# Altium schematic sheet MCU.SchDoc
size A3
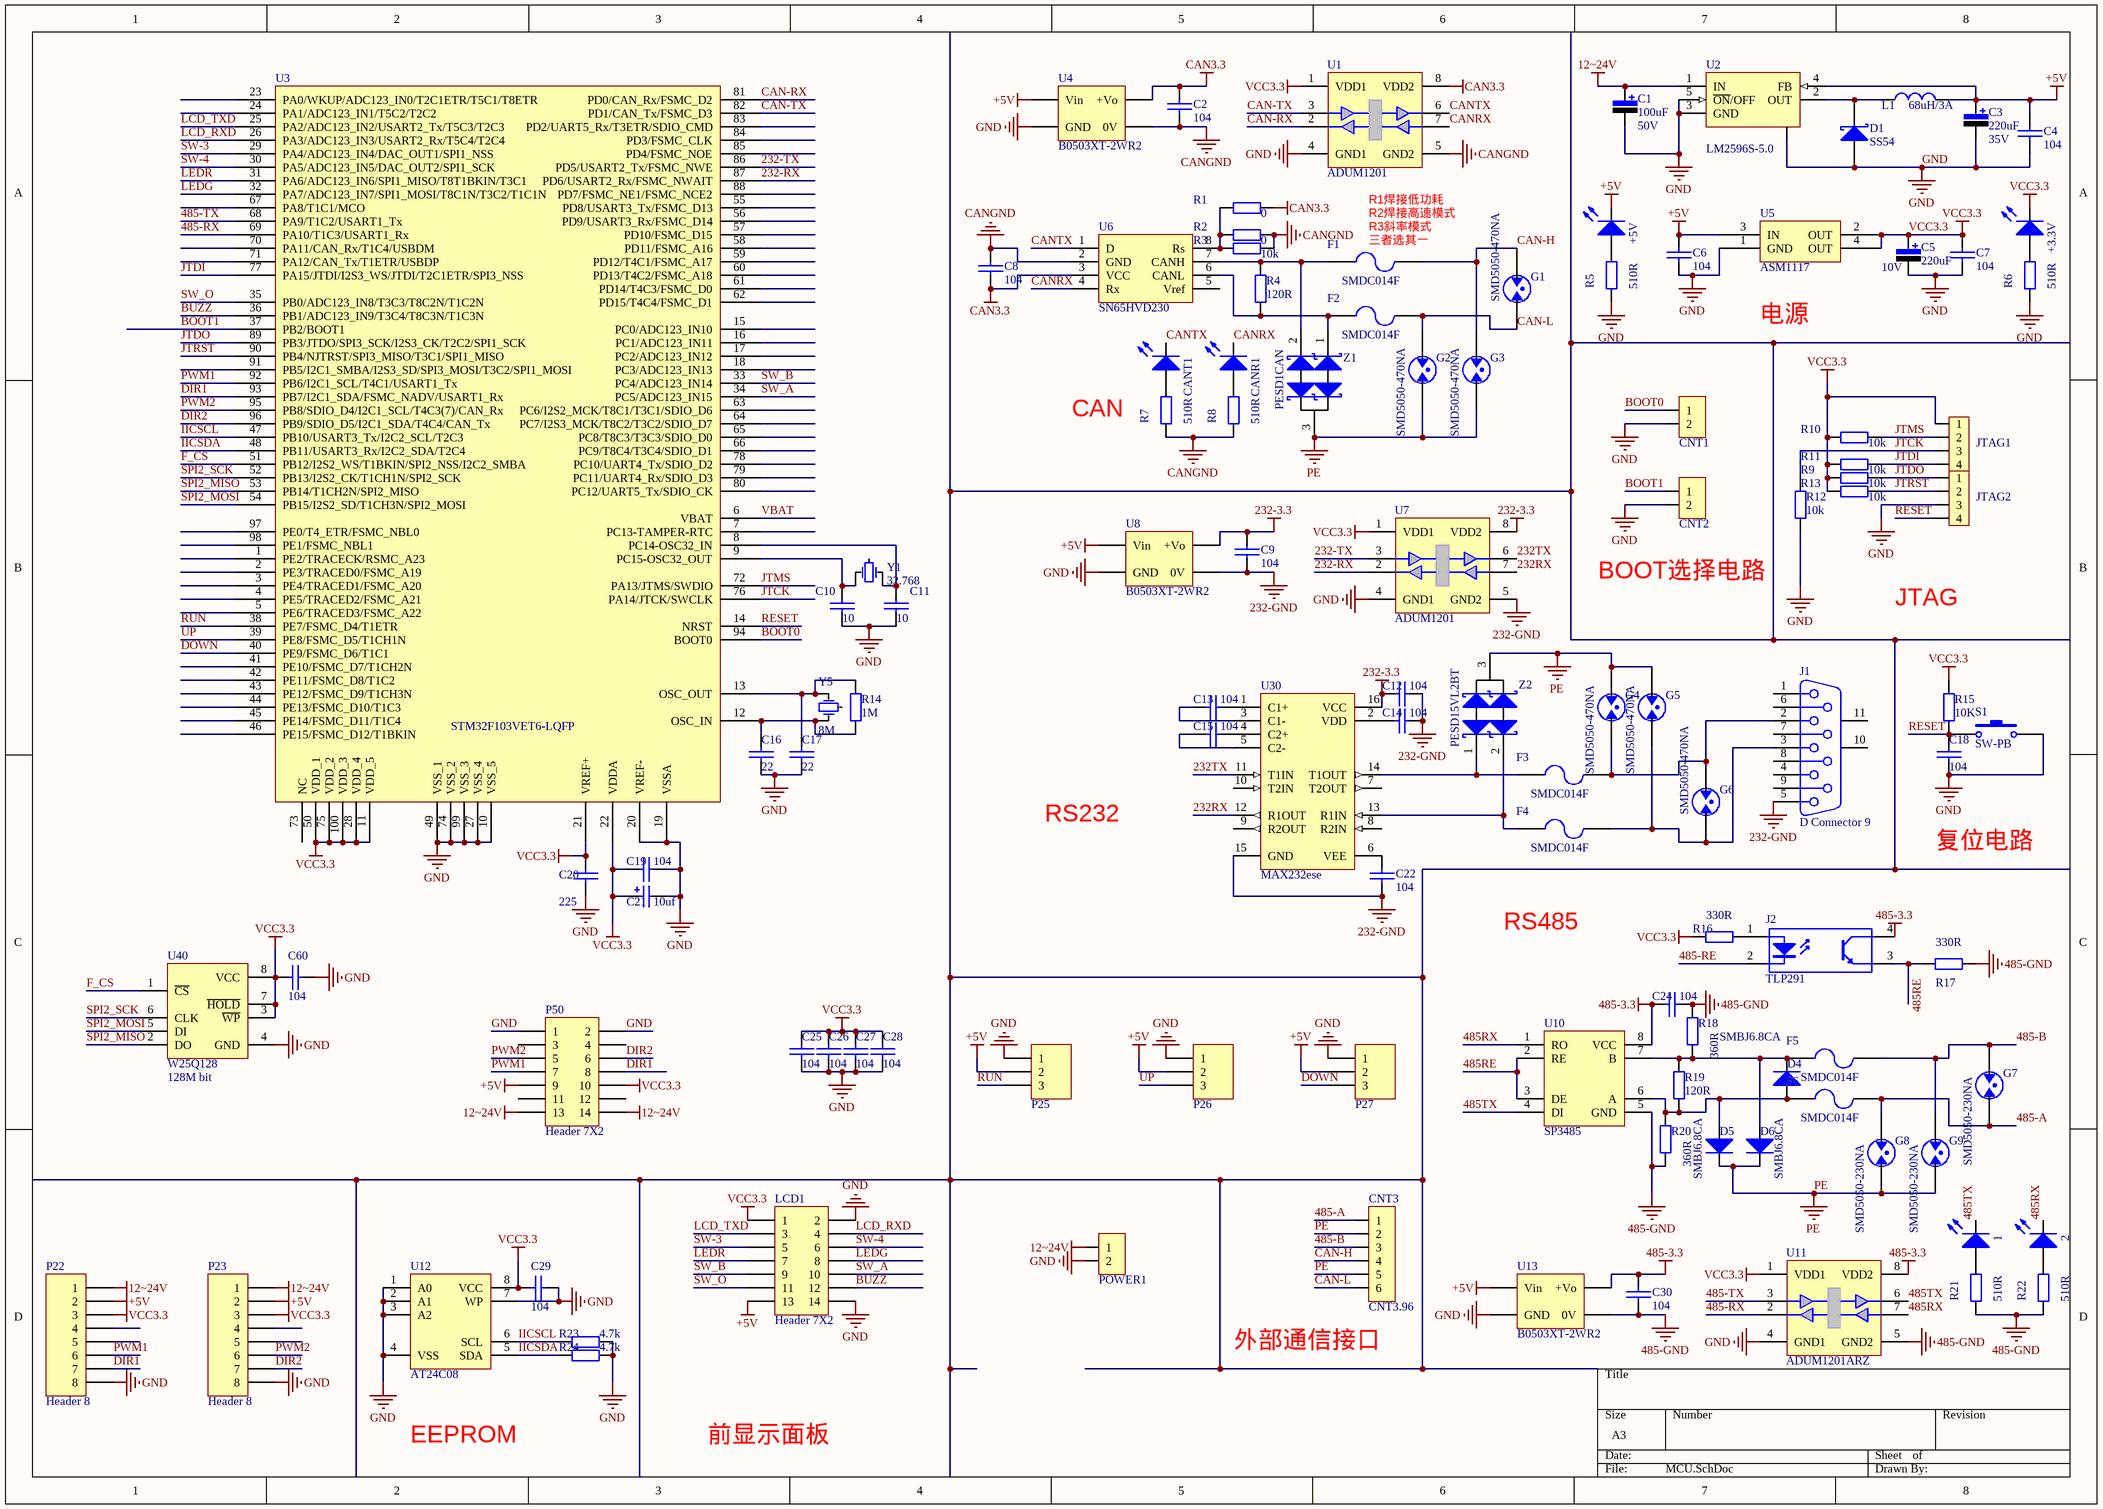
[diagram p0: MCU.SchDoc]

## Parts
1  COLOUR  [0603LED]  (value not drawn)
2  COLOUR  [0603LED]  (value not drawn)
+3.3V  COLOUR  [0603LED]  (value not drawn)
+5V  COLOUR  [0603LED]  (value not drawn)
C1  value 100uF  Vol: 50V  [C-RB-S10]  (hidden comment: Cap Pol)
C2  104  [0603C]
C3  value 220uF  Vol: 35V  [C-RB-S10]  (hidden comment: Cap Pol)
C4  104  [0603C]
C5  value 220uF  Vol: 10V  [CAP-7343]  (hidden comment: Cap Pol)
C6  104  [0603C]
C7  104  [0603C]
C8  104  [0603C]
C9  104  [0603C]
C10  10  [0603C]
C11  10  [0603C]
C12  104  [0603C]
C13  104  [0603C]
C14  104  [0603C]
C15  104  [0603C]
C16  22  [0603C]
C17  22  [0603C]
C18  104  [0603C]
C19  104  [0603C]
C20  225  [0603C]
C21  10uf  [ct3216-18]
C22  104  [0603C]
C24  104  [0603C]
C25  104  [0603C]
C26  104  [0603C]
C27  104  [0603C]
C28  104  [0603C]
C29  104  [0603C]
C30  104  [0603C]
C60  104  [0603C]
CANR1  COLOUR  [0603LED]  (value not drawn)
CANT1  COLOUR  [0603LED]  (value not drawn)
CNT1  cnt2p  [cont-1]  (value not drawn)
CNT2  cnt2p  [cont-1]  (value not drawn)
CNT3  CNT3.96  [CNT3.96]
D1  Type: SS54  [DIODE-SMA]  (hidden comment: D-Schottky)
D4  Type: SMBJ6.8CA  [DIODE-SMB]  (hidden comment: TVS)
D5  Type: SMBJ6.8CA  [DIODE-SMB]  (hidden comment: TVS)
D6  Type: SMBJ6.8CA  [DIODE-SMB]  (hidden comment: TVS)
F1  SMDC014F  [1812]
F2  value SMDC014F  [1812]  (hidden comment: Fuse)
F3  SMDC014F  [1812]
F4  value SMDC014F  [1812]  (hidden comment: Fuse)
F5  SMDC014F  [1812]
F6  value SMDC014F  [1812]  (hidden comment: Fuse)
G1  SMD5050-470NA  [SMD5050]
G2  SMD5050-470NA  [SMD5050]
G3  SMD5050-470NA  [SMD5050]
G4  SMD5050-470NA  [SMD5050]
G5  SMD5050-470NA  [SMD5050]
G6  SMD5050-470NA  [SMD5050]
G7  SMD5050-230NA  [SMD5050]
G8  SMD5050-230NA  [SMD5050]
G9  SMD5050-230NA  [SMD5050]
J1  D Connector 9  [DB9-M]
J2  TLP291  [SOP127P710X350-4N]
JTAG1  单排插针11mm4p  [单排插针2.54]  (value not drawn)
JTAG2  单排插针11mm4p  [单排插针2.54]  (value not drawn)
L1  value 68uH/3A  [L-SMD-12]  (hidden comment: Inductor)
LCD1  Header 7X2  [HDR7X2_A1]
P22  Header 8  [PH2.0-8P]
P23  Header 8  [PH2.0-8P]
P25  Header 3  [XH2.54*3卧贴]  (value not drawn)
P26  Header 3  [XH2.54*3卧贴]  (value not drawn)
P27  Header 3  [XH2.54*3卧贴]  (value not drawn)
P50  Header 7X2  [HDR7X2_A1]
POWER1  CNT5.08MM*2 WAN  [CNT5.08*2WAN]  (value not drawn)
R1  value 0  [0603-1]  (hidden comment: Res1)
R2  value 0  [0603-1]  (hidden comment: Res1)
R3  value 10k  [0603-1]  (hidden comment: Res1)
R4  value 120R  [0603-1]  (hidden comment: Res1)
R5  value 510R  [0603-1]  (hidden comment: Res1)
R6  value 510R  [0603-1]  (hidden comment: Res1)
R7  value 510R  [0603-1]  (hidden comment: Res1)
R8  value 510R  [0603-1]  (hidden comment: Res1)
R9  value 10k  [0603-1]  (hidden comment: Res1)
R10  value 10k  [0603-1]  (hidden comment: Res1)
R11  value 10k  [0603-1]  (hidden comment: Res1)
R12  value 10k  [0603-1]  (hidden comment: Res1)
R13  value 10k  [0603-1]  (hidden comment: Res1)
R14  value 1M  [0603-1]  (hidden comment: Res1)
R15  value 10K  [0603-1]  (hidden comment: Res1)
R16  value 330R  [0603-1]  (hidden comment: Res1)
R17  value 330R  [0603-1]  (hidden comment: Res1)
R18  value 360R  [0603-1]  (hidden comment: Res1)
R19  value 120R  [0603-1]  (hidden comment: Res1)
R20  value 360R  [0603-1]  (hidden comment: Res1)
R21  value 510R  [0603-1]  (hidden comment: Res1)
R22  value 510R  [0603-1]  (hidden comment: Res1)
R23  value 4.7k  [0603-1]  (hidden comment: Res1)
R24  value 4.7k  [0603-1]  (hidden comment: Res1)
S1  SW-PB  [SW_PB4_A1]
U1  ADUM1201  [NSO8_N]
U2  LM2596S-5.0  [TO-263-5]
U3  STM32F103VET6-LQFP  [LQFP-100_M]
U4  B0503XT-2WR2  [B_XT-2WR2]
U5  ASM1117  [SOT-223]
U6  SN65HVD230  [NSO8_N]
U7  ADUM1201  [NSO8_N]
U8  B0503XT-2WR2  [B_XT-2WR2]
U10  SP3485  [NSO8_N]
U11  ADUM1201ARZ  [NSO8_N]
U12  AT24C08  [SOIC8_N]
U13  B0503XT-2WR2  [B_XT-2WR2]
U30  MAX232ese  [NSO16_M]
U40  W25Q128  Memory: 128M bit  [SOIC8_W]
Y1  value 32.768  [MC-146]  (hidden comment: XTAL_SM)
Y5  value 8M  [xtal3225]  (hidden comment: XTAL_SM)
Z1  PESD1CAN  [SOT-23]
Z2  PESD15VL2BT  [SOT-23]

## Nets
12~24V: C1.1 P22.1 P23.1 P50.13 P50.14 POWER1.1 U2.1(IN)
232-3.3: C9.1 C12.2 U7.8(VDD2) U8.9(+Vo) U30.16(VCC)
232-GND: C9.2 C12.1 C14.1 C22.1 J1.5 U7.5(GND2) U8.8(0V) U30.15(GND)
485-3.3: C24.2 C30.1 J2.4(C) U10.8(VCC) U11.8(VDD2) U13.9(+Vo)
485-GND: C24.1 C30.2 R17.1 R18.2 R20.1 R21.1 R22.1 U10.5(GND) U11.5(GND2) U13.8(0V)
+5V: +5V.2(-) C3.1 C4.1 C6.1 L1.2 LCD1.13 P22.2 P23.2 P25.2 P26.2 P27.2 P50.9 U2.4(FB) U4.14(Vin) U5.3(IN) U8.14(Vin) U13.14(Vin)
CAN3.3: C2.1 C8.2 R1.1 U1.8(VDD2) U4.9(+Vo) U6.3(VCC)
CANGND: C2.2 C8.1 R2.1 R3.1 R7.1 R8.1 U1.5(GND2) U4.8(0V) U6.2(GND)
GND: C1.2 C3.2 C4.2 C5.2 C6.2 C7.2 C10.2 C11.2 C16.2 C17.2 C18.1 C19.1 C20.1 C21.2 C25.1 C26.1 C27.1 C28.1 C29.1 C60.1 CNT1.2 CNT2.2 D1.1(A) JTAG2.3 LCD1.2 LCD1.14 P22.8 P23.8 P25.1 P26.1 P27.1 P50.1 P50.2 POWER1.2 R5.1 R6.1 R12.2 R23.1 R24.1 S1.2 U1.4(GND1) U2.3(GND) U2.5(~{ON}/OFF) U2.6 U3.10(VSS_5) U3.19(VSSA) U3.20(VREF-) U3.27(VSS_4) U3.49(VSS_1) U3.74(VSS_2) U3.99(VSS_3) U4.1(GND) U5.1(GND) U7.4(GND1) U8.1(GND) U11.4(GND1) U12.1(A0) U12.2(A1) U12.3(A2) U12.4(VSS) U12.7(WP) U13.1(GND) U40.4(GND)
PE: CNT3.2 CNT3.5 D5.2(K) D6.2(K) G2.2 G3.2 G4.1 G5.1 G8.2 G9.2 Z1.3 Z2.3
VCC3.3: +3.3V.2(-) C5.1 C7.1 C19.2 C20.2 C21.1 C25.2 C26.2 C27.2 C28.2 C29.2 C60.2 JTAG1.1 LCD1.1 P22.3 P23.3 P50.10 R9.2 R10.2 R11.2 R13.2 R15.2 R16.2 U1.1(VDD1) U3.11(VDD_5) U3.21(VREF+) U3.22(VDDA) U3.28(VDD_4) U3.50(VDD_1) U3.75(VDD_2) U3.100(VDD_3) U5.2(OUT) U5.4(OUT) U7.1(VDD1) U11.1(VDD1) U12.8(VCC) U40.3(~{WP}) U40.7(~{HOLD}) U40.8(VCC)
232-RX: U3.87(PD6/USART2_Rx/FSMC_NWAIT) U7.2(Voa)
232-TX: U3.86(PD5/USART2_Tx/FSMC_NWE) U7.3(Vib)
232RX: U7.7(Via) U30.12(R1OUT)
232TX: U7.6(Vob) U30.11(T1IN)
485-A: CNT3.1 F6.2 G7.2 G8.1
485-B: CNT3.3 F5.2 G7.1 G9.1
485-RE: J2.2(K)
485-RX: U3.69(PA10/T1C3/USART1_Rx) U11.2(Voa)
485-TX: U3.68(PA9/T1C2/USART1_Tx) U11.3(Vib)
485RE: J2.3(E) R17.2 U10.2(RE) U10.3(DE)
485RX: 2.2(-) U10.1(RO) U11.7(Via)
485TX: 1.2(-) U10.4(DI) U11.6(Vob)
BOOT0: CNT1.1 U3.94(BOOT0)
BOOT1: CNT2.1 U3.37(PB2/BOOT1)
BUZZ: LCD1.12 U3.36(PB1/ADC123_IN9/T3C4/T8C3N/T1C3N)
CAN-H: CNT3.4 F1.2 G1.1 G3.1
CAN-L: CNT3.6 F2.2 G1.2 G2.1
CAN-RX: U1.2(Voa) U3.81(PD0/CAN_Rx/FSMC_D2)
CAN-TX: U1.3(Vib) U3.82(PD1/CAN_Tx/FSMC_D3)
CANRX: CANR1.2(-) U1.7(Via) U6.4(Rx)
CANTX: CANT1.2(-) U1.6(Vob) U6.1(D)
DIR1: P22.7 P50.8 U3.93(PB7/I2C1_SDA/FSMC_NADV/USART1_Rx)
DIR2: P23.7 P50.6 U3.96(PB9/SDIO_D5/I2C1_SDA/T4C4/CAN_Tx)
DOWN: P27.3 U3.40(PE9/FSMC_D6/T1C1)
F_CS: U3.51(PB12/I2S2_WS/T1BKIN/SPI2_NSS/I2C2_SMBA) U40.1(~{CS})
IICSCL: R23.2 U3.47(PB10/USART3_Tx/I2C2_SCL/T2C3) U12.6(SCL)
IICSDA: R24.2 U3.48(PB11/USART3_Rx/I2C2_SDA/T2C4) U12.5(SDA)
JTCK: JTAG1.3 R12.1 U3.76(PA14/JTCK/SWCLK)
JTDI: JTAG1.4 R11.1 U3.77(PA15/JTDI/I2S3_WS/JTDI/T2C1ETR/SPI3_NSS)
JTDO: JTAG2.1 R9.1 U3.89(PB3/JTDO/SPI3_SCK/I2S3_CK/T2C2/SPI1_SCK)
JTMS: JTAG1.2 R10.1 U3.72(PA13/JTMS/SWDIO)
JTRST: JTAG2.2 R13.1 U3.90(PB4/NJTRST/SPI3_MISO/T3C1/SPI1_MISO)
LCD_RXD: LCD1.4 U3.26(PA3/ADC123_IN3/USART2_Rx/T5C4/T2C4)
LCD_TXD: LCD1.3 U3.25(PA2/ADC123_IN2/USART2_Tx/T5C3/T2C3)
LEDG: LCD1.8 U3.32(PA7/ADC123_IN7/SPI1_MOSI/T8C1N/T3C2/T1C1N)
LEDR: LCD1.7 U3.31(PA6/ADC123_IN6/SPI1_MISO/T8T1BKIN/T3C1)
PWM1: P22.6 P50.7 U3.92(PB6/I2C1_SCL/T4C1/USART1_Tx)
PWM2: P23.6 P50.5 U3.95(PB8/SDIO_D4/I2C1_SCL/T4C3(7)/CAN_Rx)
RESET: C18.2 JTAG2.4 R15.1 S1.1 U3.14(NRST)
RUN: P25.3 U3.38(PE7/FSMC_D4/T1ETR)
SPI2_MISO: U3.53(PB14/T1CH2N/SPI2_MISO) U40.2(DO)
SPI2_MOSI: U3.54(PB15/I2S2_SD/T1CH3N/SPI2_MOSI) U40.5(DI)
SPI2_SCK: U3.52(PB13/I2S2_CK/T1CH1N/SPI2_SCK) U40.6(CLK)
SW-3: LCD1.5 U3.29(PA4/ADC123_IN4/DAC_OUT1/SPI1_NSS)
SW-4: LCD1.6 U3.30(PA5/ADC123_IN5/DAC_OUT2/SPI1_SCK)
SW_A: LCD1.10 U3.34(PC5/ADC123_IN15)
SW_B: LCD1.9 U3.33(PC4/ADC123_IN14)
SW_O: LCD1.11 U3.35(PB0/ADC123_IN8/T3C3/T8C2N/T1C2N)
UP: P26.3 U3.39(PE8/FSMC_D5/T1CH1N)
VBAT: U3.6(VBAT)
Net1_1: 1.1(+) R21.2
Net2_1: 2.1(+) R22.2
Net+3.3V_1: +3.3V.1(+) R6.2
Net+5V_1: +5V.1(+) R5.2
NetC10_1: C10.1 U3.9(PC15-OSC32_OUT) Y1.1(OSC1)
NetC11_1: C11.1 U3.8(PC14-OSC32_IN) Y1.2(OSC2)
NetC13_1: C13.1 U30.1(C1+)
NetC13_2: C13.2 U30.3(C1-)
NetC14_2: C14.2 U30.2(VDD)
NetC15_1: C15.1 U30.4(C2+)
NetC15_2: C15.2 U30.5(C2-)
NetC16_1: C16.1 R14.1 U3.12(OSC_IN) Y5.1(OSC1)
NetC17_1: C17.1 R14.2 U3.13(OSC_OUT) Y5.2(OSC2)
NetC22_2: C22.2 U30.6(VEE)
NetCANR1_1: CANR1.1(+) R8.2
NetCANT1_1: CANT1.1(+) R7.2
NetD1_2: D1.2(K) L1.1 U2.2(OUT)
NetD4_1: D4.1(A) D5.1(A) F6.1 R19.1 R20.2 U10.6(A)
NetD4_2: D4.2(K) D6.1(A) F5.1 R18.1 R19.2 U10.7(B)
NetF1_1: F1.1 R4.2 U6.7(CANH) Z1.2
NetF2_1: F2.1 R4.1 U6.6(CANL) Z1.1
NetF3_1: F3.1 U30.14(T1OUT) Z2.1
NetF3_2: F3.2 G4.2 G6.1 J1.2
NetF4_1: F4.1 U30.13(R1IN) Z2.2
NetF4_2: F4.2 G5.2 G6.2 J1.3
NetJ2_1: J2.1(A) R16.1
NetR1_2: R1.2 R2.2 R3.2 U6.8(Rs)

Not connected (* = marked no-connect by the designer): J1 1 4 6 7 8 9 10(MH1) 11(MH2); P22 4 5; P23 4 5; P50 3 4 11 12; U3 1(PE2/TRACECK/RSMC_A23) 2(PE3/TRACED0/FSMC_A19) 3(PE4/TRACED1/FSMC_A20) 4(PE5/TRACED2/FSMC_A21) 5(PE6/TRACED3/FSMC_A22) 7(PC13-TAMPER-RTC) 15(PC0/ADC123_IN10) 16(PC1/ADC123_IN11) 17(PC2/ADC123_IN12) 18(PC3/ADC123_IN13) 23(PA0/WKUP/ADC123_IN0/T2C1ETR/T5C1/T8ETR) 24(PA1/ADC123_IN1/T5C2/T2C2) 41(PE10/FSMC_D7/T1CH2N) 42(PE11/FSMC_D8/T1C2) 43(PE12/FSMC_D9/T1CH3N) 44(PE13/FSMC_D10/T1C3) 45(PE14/FSMC_D11/T1C4) 46(PE15/FSMC_D12/T1BKIN) 55(PD8/USART3_Tx/FSMC_D13) 56(PD9/USART3_Rx/FSMC_D14) 57(PD10/FSMC_D15) 58(PD11/FSMC_A16) 59(PD12/T4C1/FSMC_A17) 60(PD13/T4C2/FSMC_A18) 61(PD14/T4C3/FSMC_D0) 62(PD15/T4C4/FSMC_D1) 63(PC6/I2S2_MCK/T8C1/T3C1/SDIO_D6) 64(PC7/I2S3_MCK/T8C2/T3C2/SDIO_D7) 65(PC8/T8C3/T3C3/SDIO_D0) 66(PC9/T8C4/T3C4/SDIO_D1) 67(PA8/T1C1/MCO) 70(PA11/CAN_Rx/T1C4/USBDM) 71(PA12/CAN_Tx/T1ETR/USBDP) 73(NC) 78(PC10/UART4_Tx/SDIO_D2) 79(PC11/UART4_Rx/SDIO_D3) 80(PC12/UART5_Tx/SDIO_CK) 83(PD2/UART5_Rx/T3ETR/SDIO_CMD) 84(PD3/FSMC_CLK) 85(PD4/FSMC_NOE) 88(PD7/FSMC_NE1/FSMC_NCE2) 91(PB5/I2C1_SMBA/I2S3_SD/SPI3_MOSI/T3C2/SPI1_MOSI) 97(PE0/T4_ETR/FSMC_NBL0) 98(PE1/FSMC_NBL1); U6 5(Vref); U30 7(T2OUT) 8(R2IN) 9(R2OUT) 10(T2IN); Y1 3; Y5 3

## Notes on the sheet
- R1焊接低功耗
- R2焊接高速模式
- (near F1) R3斜率模式
- (near F1) 三者选其一
- 电源
- CAN
- BOOT选择电路
- JTAG
- RS232
- 复位电路
- RS485
- 外部通信接口
- EEPROM
- 前显示面板

## Library data of the parts
1 2 +3.3V +5V CANR1 CANT1 = ledφ6
C1 C3 C5 = Cap Pol: 极性电解电容; Published: 8-Jun-2000; LatestRevisionDate: 17-Jul-2002; LatestRevisionNote: Re-released for DXP Platform.; PackageReference: RB7.6-15; Publisher: Altium Limited
C2 C4 C6-C20 C22 C24-C30 C60 = CAP X: 安规电容
C21 = CAP: 电解电容
CNT3 = CNT3.96: 接线端子(3.96MM)
D1 = D-Schottky: 肖特基二极管; Published: 8-Jun-2000; LatestRevisionDate: 17-Jul-2002; LatestRevisionNote: Re-released for DXP Platform.; PackageReference: SMB; Publisher: Altium Limited; Code_JEDEC: DO-214-AA
D4-D6 = TVS: TVS保护; Published: 8-Jun-2000; LatestRevisionDate: 17-Jul-2002; LatestRevisionNote: Re-released for DXP Platform.; PackageDocument: Sep-1996; PackageReference: SMC; Publisher: Altium Limited; Code_JEDEC: DO-214-AB
F1-F6 = Fuse 2: 保险丝; Published: 8-Jun-2000; LatestRevisionDate: 17-Jul-2002; LatestRevisionNote: Re-released for DXP Platform.; PackageReference: PIN-W2/E2.8; Publisher: Altium Limited
  F1 F3 F5: Value: SMDC014F
G1-G9 = SMD5050-230NA: 230V 气体放电管
J1 = D Connector 9: 串口; PackageDocument: O; Positions: 9; Gender: Receptacle; Published: 15-Jun-2001; LatestRevisionDate: 17-Jul-2002; LatestRevisionNote: Re-released for DXP Platform.; DatasheetDocument: 1-Sep-1999; PackageReference: 788750; Publisher: Altium Limited; Orientation: Right Angle
J2 = TLP281: 光耦; Published: 24-Mar-1999; LatestRevisionDate: 04-Mar-2005; LatestRevisionNote: Sch pins 3 & 4 Swapped.; DatasheetDocument: Nov-2003; PackageReference: DIP-4; Publisher: Altium Limited
L1 = Inductor: 电感; Code_IEC: 1005; Published: 8-Jun-2000; LatestRevisionDate: 17-Jul-2002; LatestRevisionNote: Re-released for DXP Platform.; PackageReference: 0402-A; Publisher: Altium Limited; Code_JEITA: 0402
LCD1 P50 = Header 7X2: Header, 7-Pin; LatestRevisionDate: 17-Jul-2002; LatestRevisionNote: Re-released for DXP Platform.; Publisher: Altium Limited
P22 P23 = Header 8: Header, 8-Pin; LatestRevisionDate: 17-Jul-2002; LatestRevisionNote: Re-released for DXP Platform.; Publisher: Altium Limited
P25-P27 = Header 3: 接插件; LatestRevisionDate: 17-Jul-2002; LatestRevisionNote: Re-released for DXP Platform.; Publisher: Altium Limited
R1-R24 = Res1: 贴片电阻; Published: 8-Jun-2000; LatestRevisionDate: 17-Jul-2002; LatestRevisionNote: Re-released for DXP Platform.; PackageReference: AXIAL-0.4; Publisher: Altium Limited
S1 = SW-PB: 微动开关; Published: 24-Mar-1999; LatestRevisionDate: 17-Jul-2002; LatestRevisionNote: Re-released for DXP Platform.; PackageReference: SPST-2; Publisher: Altium Limited
U1 U7 U11 = ADUM1201: ADI隔离芯片
U2 = LM2596S-5.0: 5V稳压芯片; Note: Tab is connected to GND; Published: 15-Apr-2002; DatasheetVersion: Dec-1997; PackageReference: TS5B; Publisher: Altium Limited; PackageDescription: D2-PAK; 5 Leads; Body 14.4 (inc. leads) x 10.4 mm (LxW max); ComponentLink1Description: Manufacturer Link; ComponentLink1URL: http://www.national.com/; ComponentLink2Description: Datasheet; ComponentLink2URL: http://www.national.com/ds.cgi/LM/LM2596.pdf; ComponentLink3Description: URL Link1; ComponentLink3URL: http://www.national.com/pf/LM/LM2596.html
U3 = STM32F103V: STM32单片机100引脚
U4 U8 U13 = B0503D-2WR2: 5v-3.3v-2w隔离电源
U5 = ASM1117: 3.3V稳压芯片
U6 = SN65HVD230: CAN芯片
U10 = SP3485: 485总线芯片
U12 = AT24C02: EEROM存储器
U30 = MAX232: +5V Powered, Multi-Channel RS-232 Driver/Receiver; Published: 16-Jan-2001; LatestRevisionDate: 13-Apr-2006; LatestRevisionNote: IPC-7351 Footprint Added.; PackageReference: NSO16; Publisher: Altium Limited; PackageDescription: 16-Pin Small Outline Integrated Circuit 1.27 mm Pitch; Code_JEDEC: MS-012-AC; Code_IPC: SOIC127P600-16; ComponentLink1Description: Manufacturer Link; ComponentLink1URL: http://www.maxim-ic.com/; ComponentLink2Description: Datasheet; ComponentLink2URL: http://pdfserv.maxim-ic.com/en/ds/MAX220-MAX249.pdf
U40 = W25QXX: SPI FLASH
Y1 Y5 = XTAL_SM: 圆柱晶振; Published: 8-Jun-2000; LatestRevisionDate: 17-Jul-2002; LatestRevisionNote: Re-released for DXP Platform.; PackageReference: R38; Publisher: Altium Limited
Z1 Z2 = PESD1CAN: 过压保护